# EAGLE design BarRange (EAGLE 9.4.1)
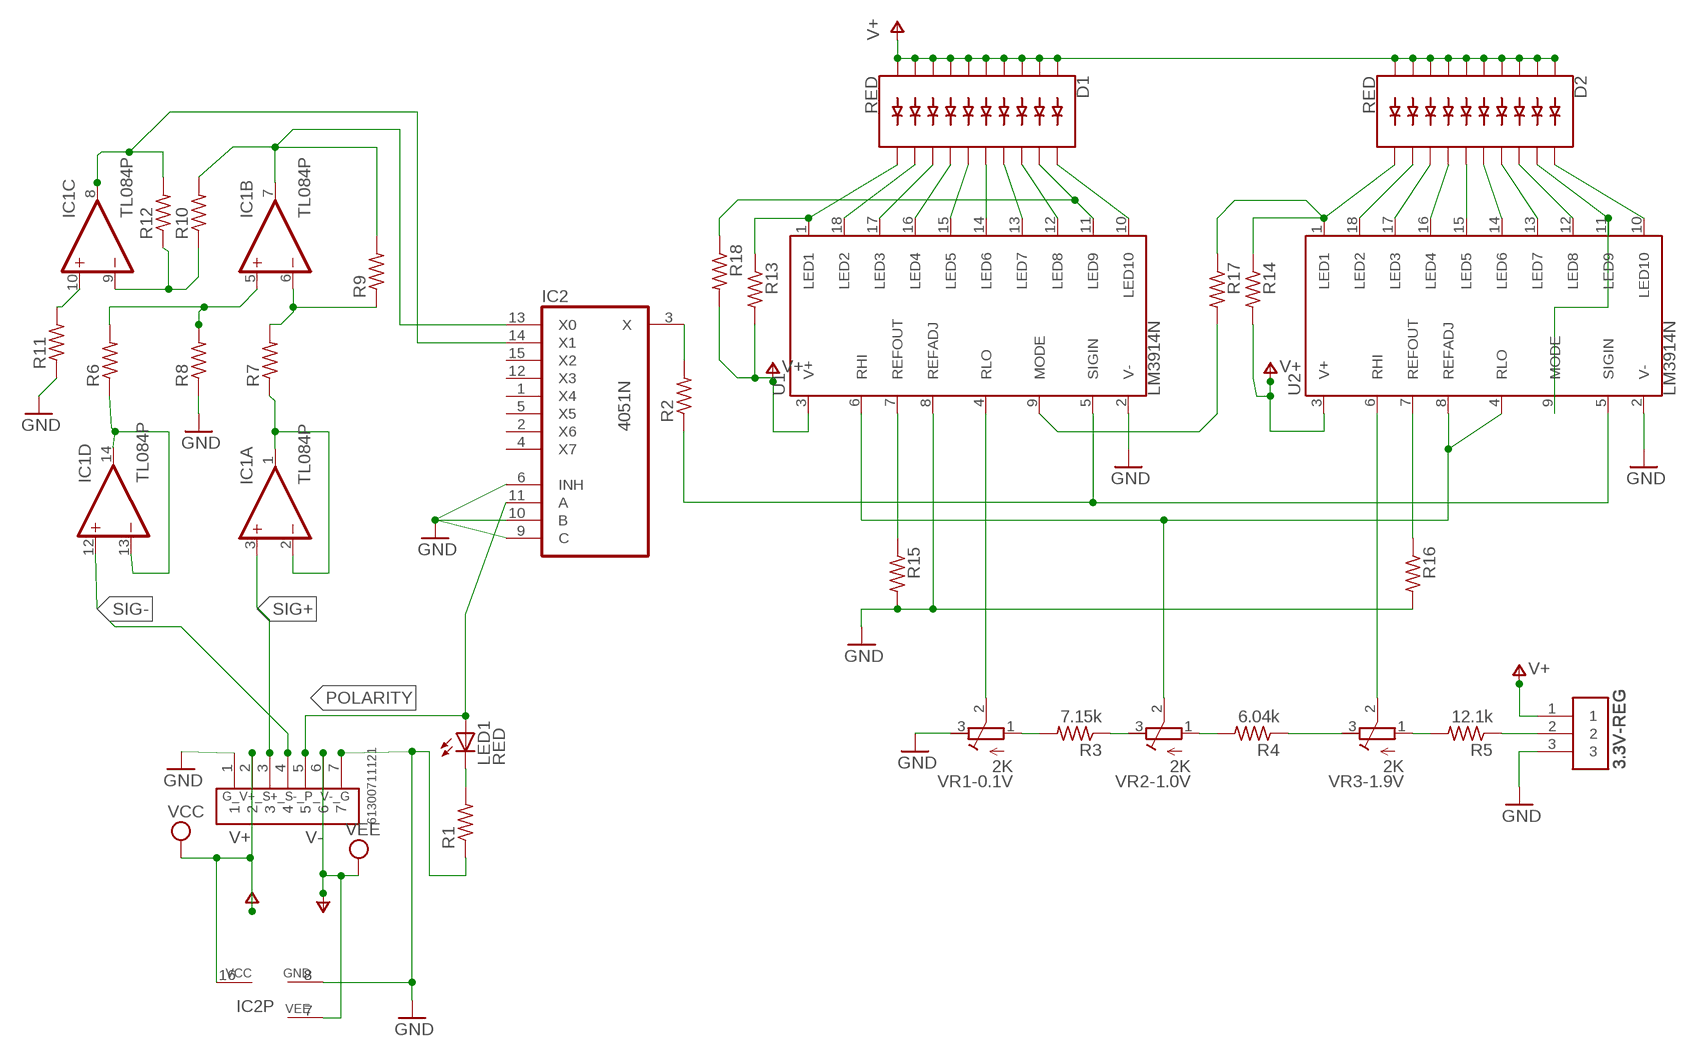
[diagram p0: schematic, sheet 1]

## Parts
3.3V-REG  3.3V-REG  61300311121  [61300311121]
D1  RED  LED_BARGRAPH_10RED  [LED_BARGRAPH_10]
D2  RED  LED_BARGRAPH_10RED  [LED_BARGRAPH_10]
G_V+_S+_S-_P_V-_G  61300711121  [61300711121]
IC1  TL084P  [DIL14]
IC2  4051N  [DIL16]
LED1  RED  LED5MM  [LED5MM]
R1  R-US_0204/7  [0204/7]
R2  R-US_0204/7  [0204/7]
R3  7.15k  R-US_0204/7  [0204/7]
R4  6.04k  R-US_0204/7  [0204/7]
R5  12.1k  R-US_0204/7  [0204/7]
R6  R-US_0204/7  [0204/7]
R7  R-US_0204/7  [0204/7]
R8  R-US_0204/7  [0204/7]
R9  R-US_0204/7  [0204/7]
R10  R-US_0204/7  [0204/7]
R11  R-US_0204/7  [0204/7]
R12  R-US_0204/7  [0204/7]
R13  R-US_0204/7  [0204/7]
R14  R-US_0204/7  [0204/7]
R15  R-US_0204/7  [0204/7]
R16  R-US_0204/7  [0204/7]
R17  R-US_0204/7  [0204/7]
R18  R-US_0204/7  [0204/7]
U1  LM3914N  [DIL18]
U2  LM3914N  [DIL18]
VR1-0.1V  2K  R-TRIMM3299W  [RTRIM3299W]
VR2-1.0V  2K  R-TRIMM3299W  [RTRIM3299W]
VR3-1.9V  2K  R-TRIMM3299W  [RTRIM3299W]

## Nets
GND: 3.3V-REG.3 G_V+_S+_S-_P_V-_G.1 G_V+_S+_S-_P_V-_G.7 IC2.6(INH) IC2.8(GND) IC2.9(C) IC2.10(B) R1.1 R8.1 R11.1 R15.2 R16.2 U1.2(V-) U1.8(REFADJ) U2.2(V-) VR1-0.1V.3(E)
N$1: IC1.5(B:+IN) R6.2 R8.2
N$2: D1.11(C9) R13.1 U1.1(LED1)
N$3: D1.12(C8) U1.18(LED2)
N$4: D1.13(C7) U1.17(LED3)
N$5: D1.14(C6) U1.16(LED4)
N$6: D1.15(C5) U1.15(LED5)
N$7: D1.16(C4) U1.14(LED6)
N$8: D1.17(C3) U1.13(LED7)
N$9: D1.18(C2) U1.12(LED8)
N$10: D1.19(C1) R18.1 U1.11(LED9)
N$11: D1.20(C) U1.10(LED10)
N$12: D2.11(C9) R14.1 R17.1 U2.1(LED1)
N$13: D2.12(C8) U2.18(LED2)
N$14: D2.13(C7) U2.17(LED3)
N$15: D2.14(C6) U2.16(LED4)
N$16: D2.15(C5) U2.15(LED5)
N$17: D2.16(C4) U2.14(LED6)
N$18: D2.17(C3) U2.13(LED7)
N$19: D2.18(C2) U2.12(LED8)
N$20: D2.19(C1) U2.9(MODE) U2.11(LED9)
N$21: D2.20(C) U2.10(LED10)
N$22: LED1.K(C) R1.2
N$23: IC2.3(X) R2.2
N$24: R2.1 U1.5(SIGIN) U2.5(SIGIN)
N$25: R3.2 VR1-0.1V.1(A)
N$26: R3.1 VR2-1.0V.3(E)
N$27: R4.2 VR2-1.0V.1(A)
N$28: R4.1 VR3-1.9V.3(E)
N$29: R5.2 VR3-1.9V.1(A)
N$30: 3.3V-REG.2 R5.1
N$31: U1.6(RHI) U2.4(RLO) U2.8(REFADJ) VR2-1.0V.2(S)
N$32: IC1.1(A:OUT) IC1.2(A:-IN) R7.1
N$33: U1.4(RLO) VR1-0.1V.2(S)
N$34: IC1.13(D:-IN) IC1.14(D:OUT) R6.1
N$35: IC1.6(B:-IN) R7.2 R9.1
N$36: IC1.7(B:OUT) IC2.13(X0) R9.2 R10.2
N$37: IC1.10(C:+IN) R11.2
N$38: IC1.9(C:-IN) R10.1 R12.1
N$39: IC1.8(C:OUT) IC2.14(X1) R12.2
N$40: U2.6(RHI) VR3-1.9V.2(S)
N$41: R16.1 U2.7(REFOUT)
N$42: R15.1 U1.7(REFOUT)
N$43: R17.2 U1.9(MODE)
POLARITY: G_V+_S+_S-_P_V-_G.5 IC2.11(A) LED1.A
SIG+: G_V+_S+_S-_P_V-_G.3 IC1.3(A:+IN)
SIG-: G_V+_S+_S-_P_V-_G.4 IC1.12(D:+IN)
V+: 3.3V-REG.1 D1.1(A) D1.2(A1) D1.3(A2) D1.4(A3) D1.5(A4) D1.6(A5) D1.7(A6) D1.8(A7) D1.9(A8) D1.10(A9) D2.1(A) D2.2(A1) D2.3(A2) D2.4(A3) D2.5(A4) D2.6(A5) D2.7(A6) D2.8(A7) D2.9(A8) D2.10(A9) G_V+_S+_S-_P_V-_G.2 IC2.16(VCC) R13.2 R14.2 R18.2 U1.3(V+) U2.3(V+) ; supply symbol labelled VCC
V-: G_V+_S+_S-_P_V-_G.6 IC2.7(VEE) ; supply symbol labelled VEE
Unconnected: IC2.1(X4) IC2.2(X6) IC2.4(X7) IC2.5(X5) IC2.12(X3) IC2.15(X2)

## Power pins joined to a net without a drawn wire
V+: IC1.4(P:V+)
V-: IC1.11(P:V-)

## Library data of the parts
3.3V-REG = Headers:61300311121: CONN HEADER VERT 3POS 2.54MM Manufacturer's datasheet <https://katalog.we-online.de/em/datasheet/6130xx11121.pdf>; CREATED_BY: PCBLayout.com; DIGI_KEY_PART_NUMBER: 732-5316-ND; MANUFACTURER: Wurth Electronics Inc.; MPN: 61300311121
D1 D2 = SparkFun-LED:LED_BARGRAPH_10: Young Sun LED Tech - YSLB-10251G5-10 10-Segment LED Bar Graph Features: Red Vf = 2.1V, Ifmax = 20mA Yellow Vf = 2.1V, Ifmax = 20mA Blue Vf = 3.4V, Ifmax = 20mA Green Vf = 3.4V, Ifmax = 20mA SparkFun Products: Red <https://www.sparkfun.com/products/9935> Yellow <https://www.sparkfun.com/products/9936> Green <https://www.sparkfun.com/products/9938> Blue <https://www.sparkfun.com/products/9937>; PROD_ID: DIO-10615
G_V+_S+_S-_P_V-_G = Headers:61300711121: CONN HEADER VERT 7POS 2.54MM Manufacturer's datasheet <https://katalog.we-online.de/em/datasheet/6130xx11121.pdf>; CREATED_BY: PCBLayout.com; DIGI_KEY_PART_NUMBER: 732-5320-ND; MANUFACTURER: Wurth Electronics Inc.; MPN: 61300711121
IC1 = linear:TL084: OP AMP
IC2 = 40xx:4051: 8-channel ANALOG MULTIPLEXER
LED1 = adafruit:LED: LED OSRAM: - CHIPLED LG R971, LG N971, LY N971, LG Q971, LY Q971, LO R971, LY R971 LH N974, LH R974 LS Q976, LO Q976, LY Q976 LO Q996 - Hyper CHIPLED LW Q18S LB Q993, LB Q99A, LB R99A - SideLED LS A670, LO A670, LY A670, LG A670, LP A670 LB A673, LV A673, LT A673, LW A673 LH A674 LY A675 LS A676, LA A676, LO A676, LY A676, LW A676 LS A679, LY A679, LG A679 - Hyper Micro SIDELED® LS Y876, LA Y876, LO Y876, LY Y876 LT Y87S - SmartLED LW L88C, LW L88S LB L89C, LB L89S, LG L890 LS L89K, LO L89K, LY L89K LS L896, LA L896, LO L896, LY L896 - TOPLED LS T670, LO T670, LY T670, LG T670, LP T670 LSG T670, LSP T670, LSY T670, LOP T670, LYG T670 LG T671, LOG T671, LSG T671 LB T673, LV T673, LT T673, LW T673 LH T674 LS T676, LA T676, LO T676, LY T676, LB T676, LH T676, LSB T676, LW T676 LB T67C, LV T67C, LT T67C, LS T67K, LO T67K, LY T67K, LW E67C LS E67B, LA E67B, LO E67B, LY E67B, LB E67C, LV E67C, LT E67C LW T67C LS T679, LY T679, LG T679 LS T770, LO T770, LY T770, LG T770, LP T770 LB T773, LV T773, LT T773, LW T773 LH T774 LS E675, LA E675, LY E675, LS T675 LS T776, LA T776, LO T776, LY T776, LB T776 LHGB T686 LT T68C, LB T68C - Hyper Mini TOPLED® LB M676 - Mini TOPLED Santana® LG M470 LS M47K, LO M47K, LY M47K Source: http://www.osram.convergy.de/
R1-R18 = resistor:R-US_: RESISTOR, American symbol
U1 U2 = SparkFun-IC-Special-Function:LM391: LM3914 Dot/Bar Display Driver TTL/CMOS Logic Drives LEDs, LCDs, Vacuum Fluorecents Source: Data sheet LM3915 <http://www.national.com/ds/LM/LM3915.pdf> Data sheet LM3914 <http://www.national.com/ds/LM/LM3914.pdf> SparkFun Products: MyoWare LED Shield <https://www.sparkfun.com/products/13688> Dot/Bar Display Driver - LM3914 <https://www.sparkfun.com/products/12694>
VR1-0.1V VR2-1.0V VR3-1.9V = resistor:R-TRIMM: Trimm resistor

## Board
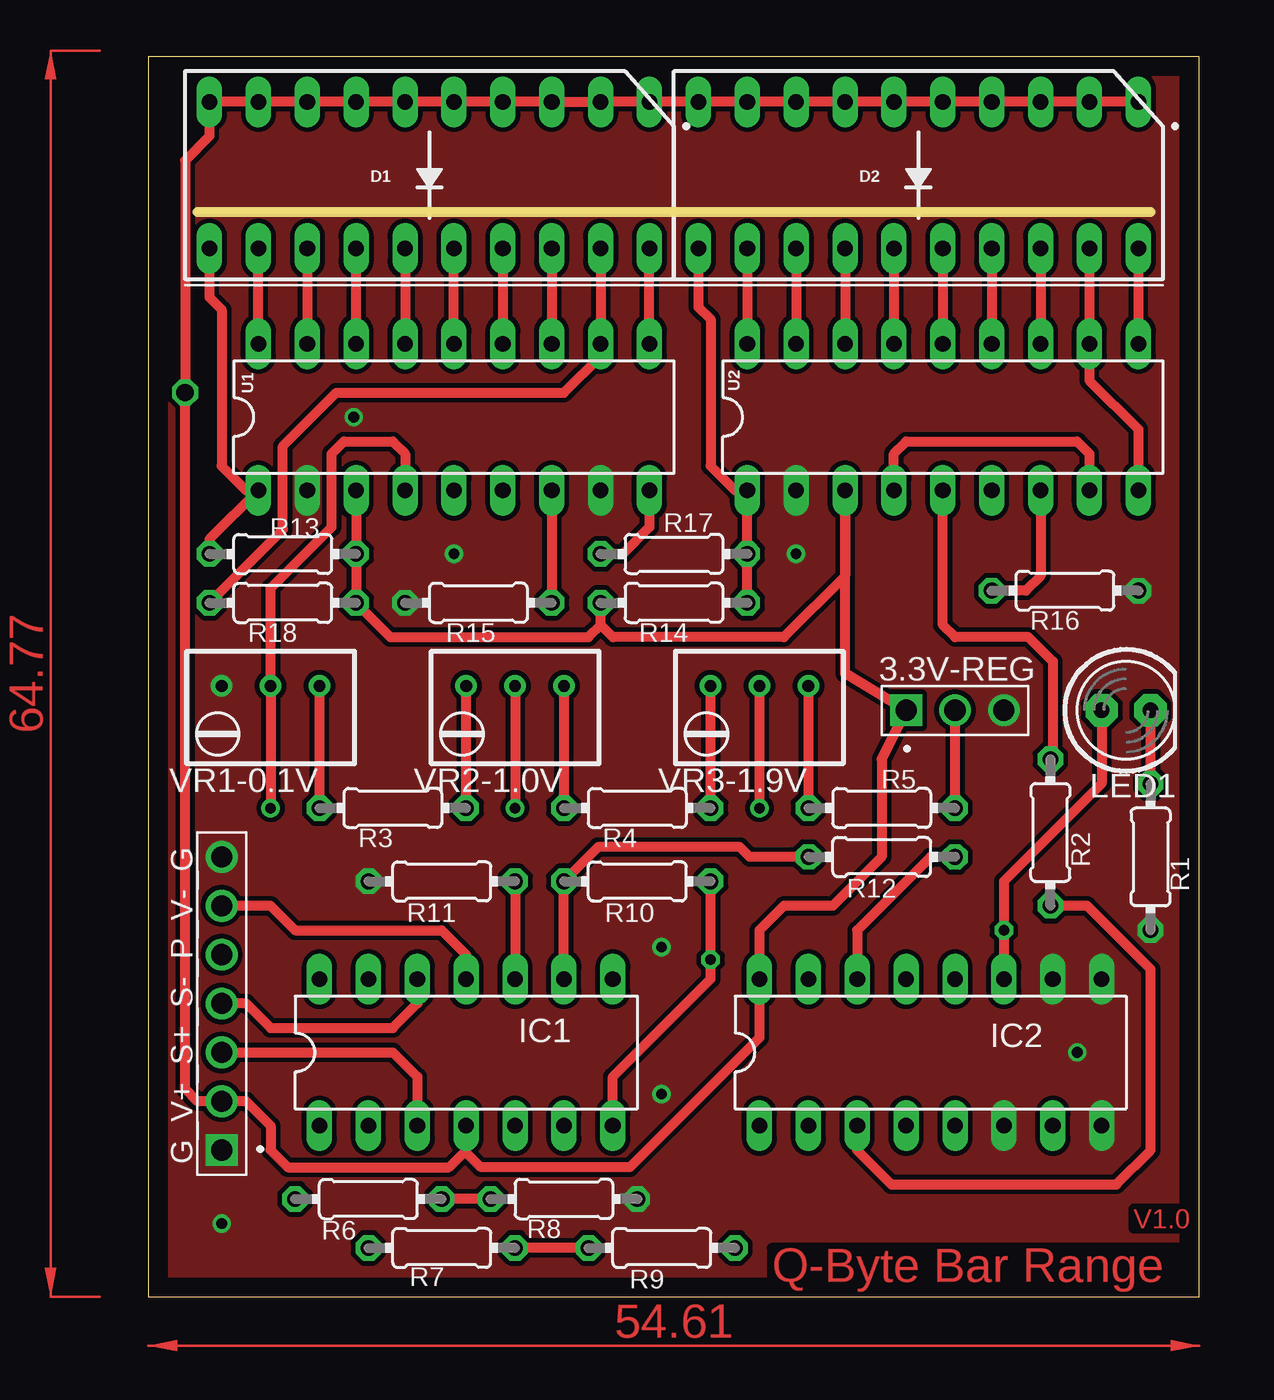
[diagram p1: board, top side]
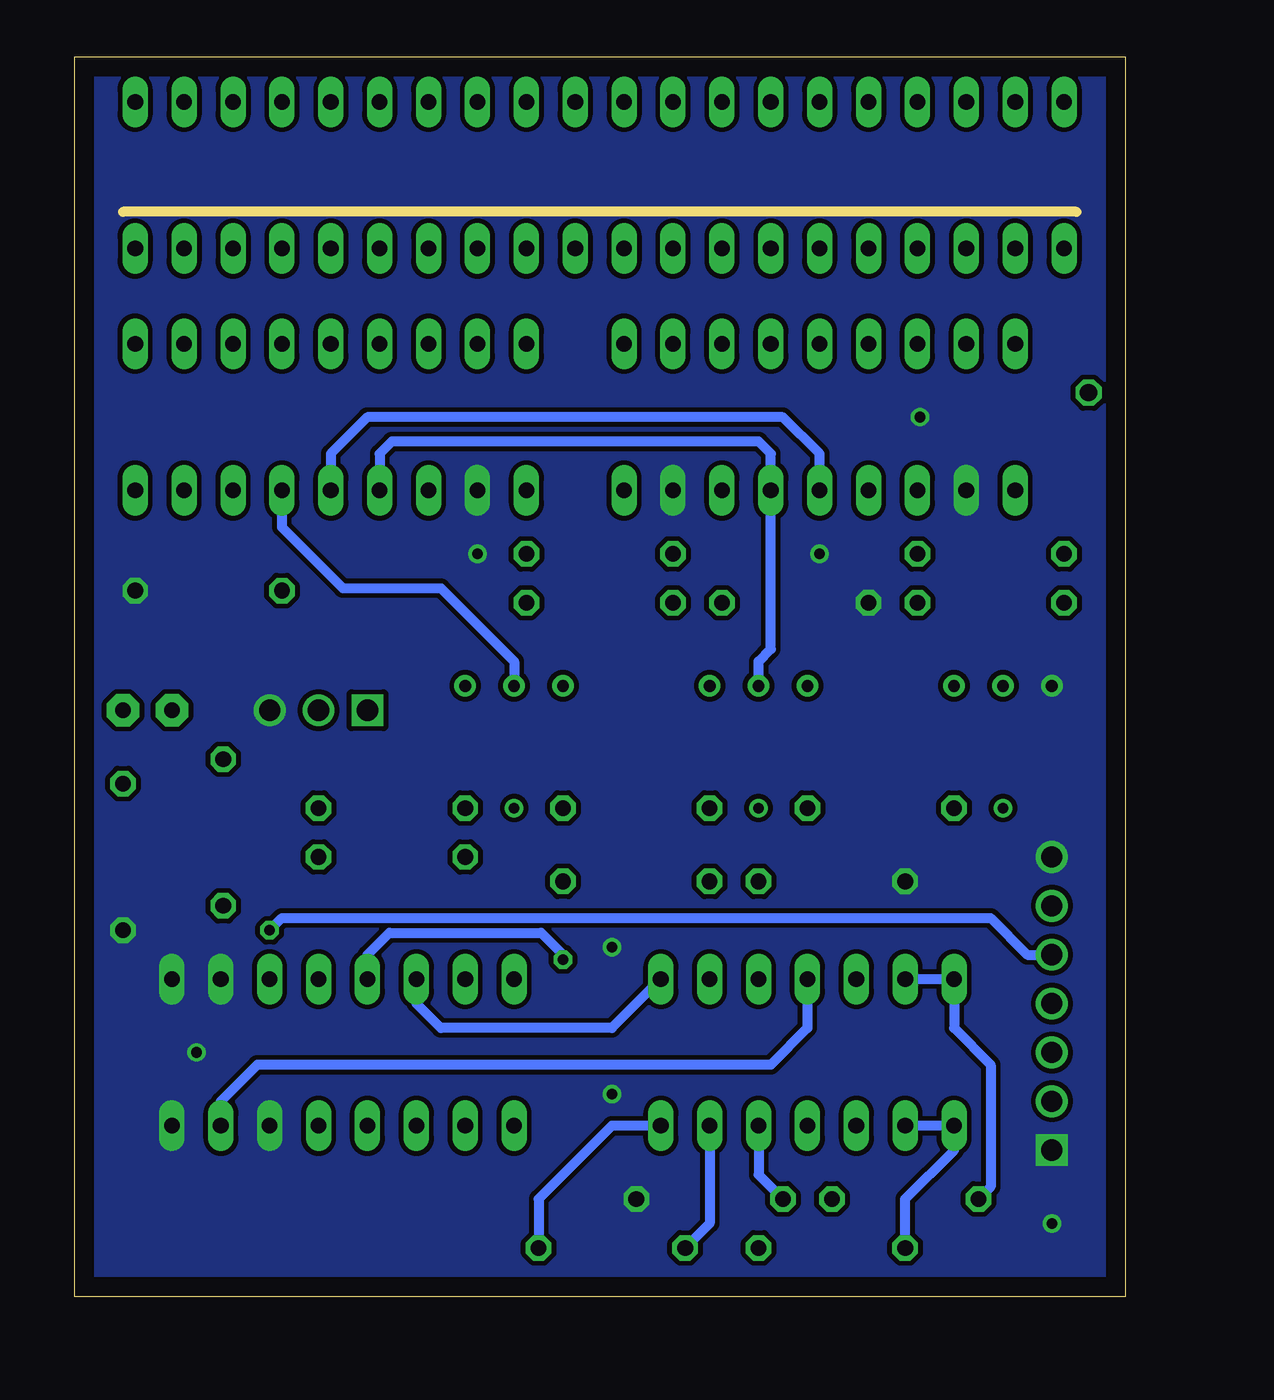
[diagram p2: board, bottom side, seen from below]

Size 54.59 x 64.44 mm. Coordinates in mm from the lower left corner, seen from the top.
Outline: 0,0 54.59,0 54.59,64.44 0,64.44 0,0
Copper layers (1*16): Top 0.035mm / dielectric 1.5mm / Bottom 0.035mm
Design rules "default *": minimum track width 6mil, minimum drill 0.35mm, track to track 10mil, track to pad 10mil, pad to pad 10mil, via to via 10mil, smd to smd 10mil, copper to edge 40mil, drill to drill 6mil, minimum pad ring 10mil, minimum via ring 8mil, stop-mask expansion 4mil, vias tented up to drill 0mil, thermal gap 0mil
Milling: 1 lines

### Footprints (pad centres in the part's own frame; a part is rotated, then mirrored left to right if it is on the bottom)
61300311121 = drill 1.1 square: 1 -2.54,0 | drill 1.1: 2 0,0; 3 2.54,0
LED_BARGRAPH_10 = drill 0.813 long: 1 -11.43,-3.81; 2 -8.89,-3.81; 3 -6.35,-3.81; 4 -3.81,-3.81; 5 -1.27,-3.81; 6 1.27,-3.81; 7 3.81,-3.81; 8 6.35,-3.81; 9 8.89,-3.81; 10 11.43,-3.81; 11 11.43,3.81; 12 8.89,3.81; 13 6.35,3.81; 14 3.81,3.81; 15 1.27,3.81; 16 -1.27,3.81; 17 -3.81,3.81; 18 -6.35,3.81; 19 -8.89,3.81; 20 -11.43,3.81
61300711121 = drill 1.1 square: 1 -7.62,0 | drill 1.1: 2 -5.08,0; 3 -2.54,0; 4 0,0; 5 2.54,0; 6 5.08,0; 7 7.62,0
DIL14 = drill 0.813 long: 1 -7.62,-3.81; 2 -5.08,-3.81; 3 -2.54,-3.81; 4 0,-3.81; 5 2.54,-3.81; 6 5.08,-3.81; 7 7.62,-3.81; 8 7.62,3.81; 9 5.08,3.81; 10 2.54,3.81; 11 0,3.81; 12 -2.54,3.81; 13 -5.08,3.81; 14 -7.62,3.81
DIL16 = drill 0.813 long: 1 -8.89,-3.81; 2 -6.35,-3.81; 3 -3.81,-3.81; 4 -1.27,-3.81; 5 1.27,-3.81; 6 3.81,-3.81; 7 6.35,-3.81; 8 8.89,-3.81; 9 8.89,3.81; 10 6.35,3.81; 11 3.81,3.81; 12 1.27,3.81; 13 -1.27,3.81; 14 -3.81,3.81; 15 -6.35,3.81; 16 -8.89,3.81
LED5MM = drill 0.813 pad 1.676 octagon: A -1.27,0; K 1.27,0
0204/7 = drill 0.813 octagon: 1 -3.81,0; 2 3.81,0
DIL18 = drill 0.813 long: 1 -10.16,-3.81; 2 -7.62,-3.81; 3 -5.08,-3.81; 4 -2.54,-3.81; 5 0,-3.81; 6 2.54,-3.81; 7 5.08,-3.81; 8 7.62,-3.81; 9 10.16,-3.81; 10 10.16,3.81; 11 7.62,3.81; 12 5.08,3.81; 13 2.54,3.81; 14 0,3.81; 15 -2.54,3.81; 16 -5.08,3.81; 17 -7.62,3.81; 18 -10.16,3.81
RTRIM3299W = drill 0.61: 1 1.27,-2.54; 2 1.27,0; 3 1.27,2.54

### Placement (x,y rotation side)
3.3V-REG  41.91,30.48 0 top
D1  14.61,58.29 180 top
D2  40.01,58.29 180 top
G_V+_S+_S-_P_V-_G  3.81,15.24 90 top
IC1  16.51,12.7 0 top
IC2  40.64,12.7 0 top
LED1  50.8,30.48 0 top
R1  52.07,22.86 90 top
R2  46.86,24.13 270 top
R3  12.7,25.4 180 top
R4  25.4,25.4 180 top
R5  38.1,25.4 180 top
R6  11.43,5.08 0 top
R7  15.24,2.54 0 top
R8  21.59,5.08 180 top
R9  26.67,2.54 0 top
R10  25.4,21.59 0 top
R11  15.24,21.59 0 top
R12  38.1,22.86 0 top
R13  6.99,38.61 0 top
R14  27.3,36.07 180 top
R15  17.14,36.07 180 top
R16  47.62,36.7 0 top
R17  27.3,38.61 180 top
R18  6.99,36.07 0 top
U1  15.88,45.72 0 top
U2  41.27,45.72 0 top
VR1-0.1V  6.35,30.48 90 top
VR2-1.0V  19.05,30.48 90 top
VR3-1.9V  31.75,30.48 90 top

### Tracks (layer width: path | path; a pad name or v marks a point on that pad's centre or on a via)
GND  (via drill 0.55)
  other vias: 3.81,3.81 48.26,12.7 26.67,10.54 26.67,18.16 15.88,38.61 33.66,38.61 10.67,45.72
  pour Bottom: -0.38,-0.51 -0.38,64.9 54.99,64.9 54.99,-0.51
  pour Top: 0,64.77 54.61,64.77 54.86,64.52 54.86,-0.25 -0.13,-0.25 -0.13,64.77
N$1
  Top 0.508: R8.2 R6.2
  Bottom 0.508: IC1.5 19.05,6.35 R8.2
N$2
  Top 0.508: R13.1 3.17,39.37 U1.1 5.08,41.91 3.81,43.18 3.81,51.31 3.17,51.94 D1.11
N$3
  Top 0.508: U1.18 D1.12
N$4
  Top 0.508: D1.13 U1.17
N$5
  Top 0.508: U1.16 D1.14
N$6
  Top 0.508: D1.15 U1.15
N$7
  Top 0.508: U1.14 D1.16
N$8
  Top 0.508: D1.17 U1.13
N$9
  Top 0.508: D1.18 U1.12
N$10
  Top 0.508: D1.19 U1.11 23.5,48.9 21.59,46.99 9.77,46.99 6.99,44.21 6.99,39.88 R18.1
N$11
  Top 0.508: U1.10 D1.20
N$12
  Top 0.508: D2.11 28.57,51.44 29.21,50.8 29.21,43.18 30.48,41.91 U2.1 R17.1 R14.1
N$13
  Top 0.508: D2.12 U2.18
N$14
  Top 0.508: D2.13 U2.17
N$15
  Top 0.508: D2.14 U2.16
N$16
  Top 0.508: D2.15 U2.15
N$17
  Top 0.508: D2.16 U2.14
N$18
  Top 0.508: D2.17 U2.13
N$19
  Top 0.508: D2.18 U2.12
N$20
  Top 0.508: D2.19 U2.11 48.9,47.62 51.44,45.09 U2.9
N$21
  Top 0.508: D2.20 U2.10
N$22
  Top 0.508: R1.2 LED1.K
N$23
  Top 0.508: IC2.3 36.83,7.62 38.61,5.84 50.29,5.84 52.07,7.62 52.07,17.02 48.77,20.32 R2.2
N$24
  Top 0.508: U2.5 41.27,34.92 41.91,34.29 45.72,34.29 46.99,33.02 46.99,28.07 R2.1
  Bottom 0.508: U1.5 15.88,43.81 17.78,45.72 39.37,45.72 41.27,43.81 U2.5
N$25
  Top 0.508: VR1-0.1V.1 R3.2
N$26
  Top 0.508: R3.1 VR2-1.0V.3
N$27
  Top 0.508: VR2-1.0V.1 R4.2
N$28
  Top 0.508: R4.1 VR3-1.9V.3
N$29
  Top 0.508: VR3-1.9V.1 R5.2
N$30
  Top 0.508: R5.1 3.3V-REG.2
N$31  (via drill 0.55)
  Top 0.508: U2.4 38.73,43.81 39.37,44.45 48.26,44.45 48.9,43.81 U2.8 | VR2-1.0V.2 v19.05,25.4
  Bottom 0.508: U2.4 38.73,43.81 38.1,44.45 19.05,44.45 18.41,43.81 U1.6 18.41,33.66 19.05,33.02 VR2-1.0V.2
N$32
  Bottom 0.508: IC1.2 IC1.1 8.89,7.62 11.43,5.08 R7.1
N$33  (via drill 0.55)
  Top 0.508: U1.4 13.34,43.81 12.7,44.45 10.16,44.45 9.53,43.81 9.53,40.01 6.35,36.83 VR1-0.1V.2 v6.35,25.4
N$34
  Bottom 0.508: IC1.13 IC1.14 8.89,13.97 6.99,12.06 6.99,5.71 R6.1
N$35
  Top 0.508: R9.1 R7.2
  Bottom 0.508: IC1.6 21.59,3.81 R9.1
N$36  (via drill 0.55)
  Top 0.508: IC1.7 24.13,11.43 29.21,16.51 v29.21,17.53 R10.2
  Bottom 0.508: IC1.7 26.67,8.89 30.48,5.08 R9.2 | IC2.13 39.37,17.78 38.23,18.92 30.35,18.92 29.21,17.78 v29.21,17.53
N$37
  Top 0.508: R11.2 IC1.10
N$38
  Top 0.508: IC1.9 R10.1 23.37,23.37 30.73,23.37 31.24,22.86 R12.1
N$39
  Top 0.508: R12.2 40.64,22.86 36.83,19.05 IC2.14
  Bottom 0.508: IC1.8 26.67,13.97 35.56,13.97 36.83,15.24 IC2.14
N$40  (via drill 0.55)
  Top 0.508: VR3-1.9V.2 v31.75,25.4
  Bottom 0.508: U2.6 43.81,40.01 40.64,36.83 35.56,36.83 31.75,33.02 VR3-1.9V.2
N$41
  Top 0.508: U2.7 46.35,37.47 45.59,36.7 R16.1
N$42
  Top 0.508: U1.7 R15.1
N$43
  Top 0.508: U1.9 26.04,40.01 24.64,38.61 R17.2
POLARITY  (via drill 0.55)
  Top 0.508: LED1.A 49.53,26.67 44.45,21.59 v44.45,19.05 IC2.11
  Bottom 0.508: v44.45,19.05 43.81,19.68 6.99,19.68 5.08,17.78 G_V+_S+_S-_P_V-_G.5
SIG+
  Top 0.508: IC1.3 13.97,11.43 12.7,12.7 G_V+_S+_S-_P_V-_G.3
SIG-
  Top 0.508: IC1.12 13.97,15.24 12.7,13.97 6.35,13.97 5.08,15.24 G_V+_S+_S-_P_V-_G.4
V+  (via drill 0.9)
  Top 0.508: U1.3 R13.2 R18.2 12.57,34.29 22.86,34.29 23.5,34.92 | 23.5,34.92 24.13,34.29 33.02,34.29 36.2,37.47 U2.3 36.2,32.38 3.3V-REG.1 38.1,27.94 38.1,22.86 35.56,20.32 33.02,20.32 31.75,19.05 IC2.16 31.75,13.46 25.02,6.73 17.27,6.73 16.51,7.49 IC1.4 16.51,7.62 15.62,6.73 7.24,6.73 6.35,7.62 6.35,8.89 5.08,10.16 G_V+_S+_S-_P_V-_G.2 2.54,10.16 1.91,10.79 v1.91,46.99 1.91,59.05 3.17,60.33 D1.10 D1.9 D1.8 D1.7 D1.6 D1.5 D1.4 D1.3 D1.2 D1.1 D2.10 D2.9 D2.8 D2.7 D2.6 D2.5 D2.4 D2.3 D2.2 D2.1 | 23.5,34.92 R14.2
V-
  Top 0.508: IC1.11 16.51,17.78 15.24,19.05 7.62,19.05 6.35,20.32 G_V+_S+_S-_P_V-_G.6
  Bottom 0.508: IC2.7 46.99,10.16 45.09,12.06 18.41,12.06 16.51,13.97 IC1.11
(copper drawn outside any net)
  shapes: Top area x2

### Text on the board
Top: V1.0 | Q-Byte Bar Range